# Altium schematic sheet E17-04_BSPD.SchDoc
size B; DocumentNumber: 10; SheetNumber: 10; SheetTotal: 18
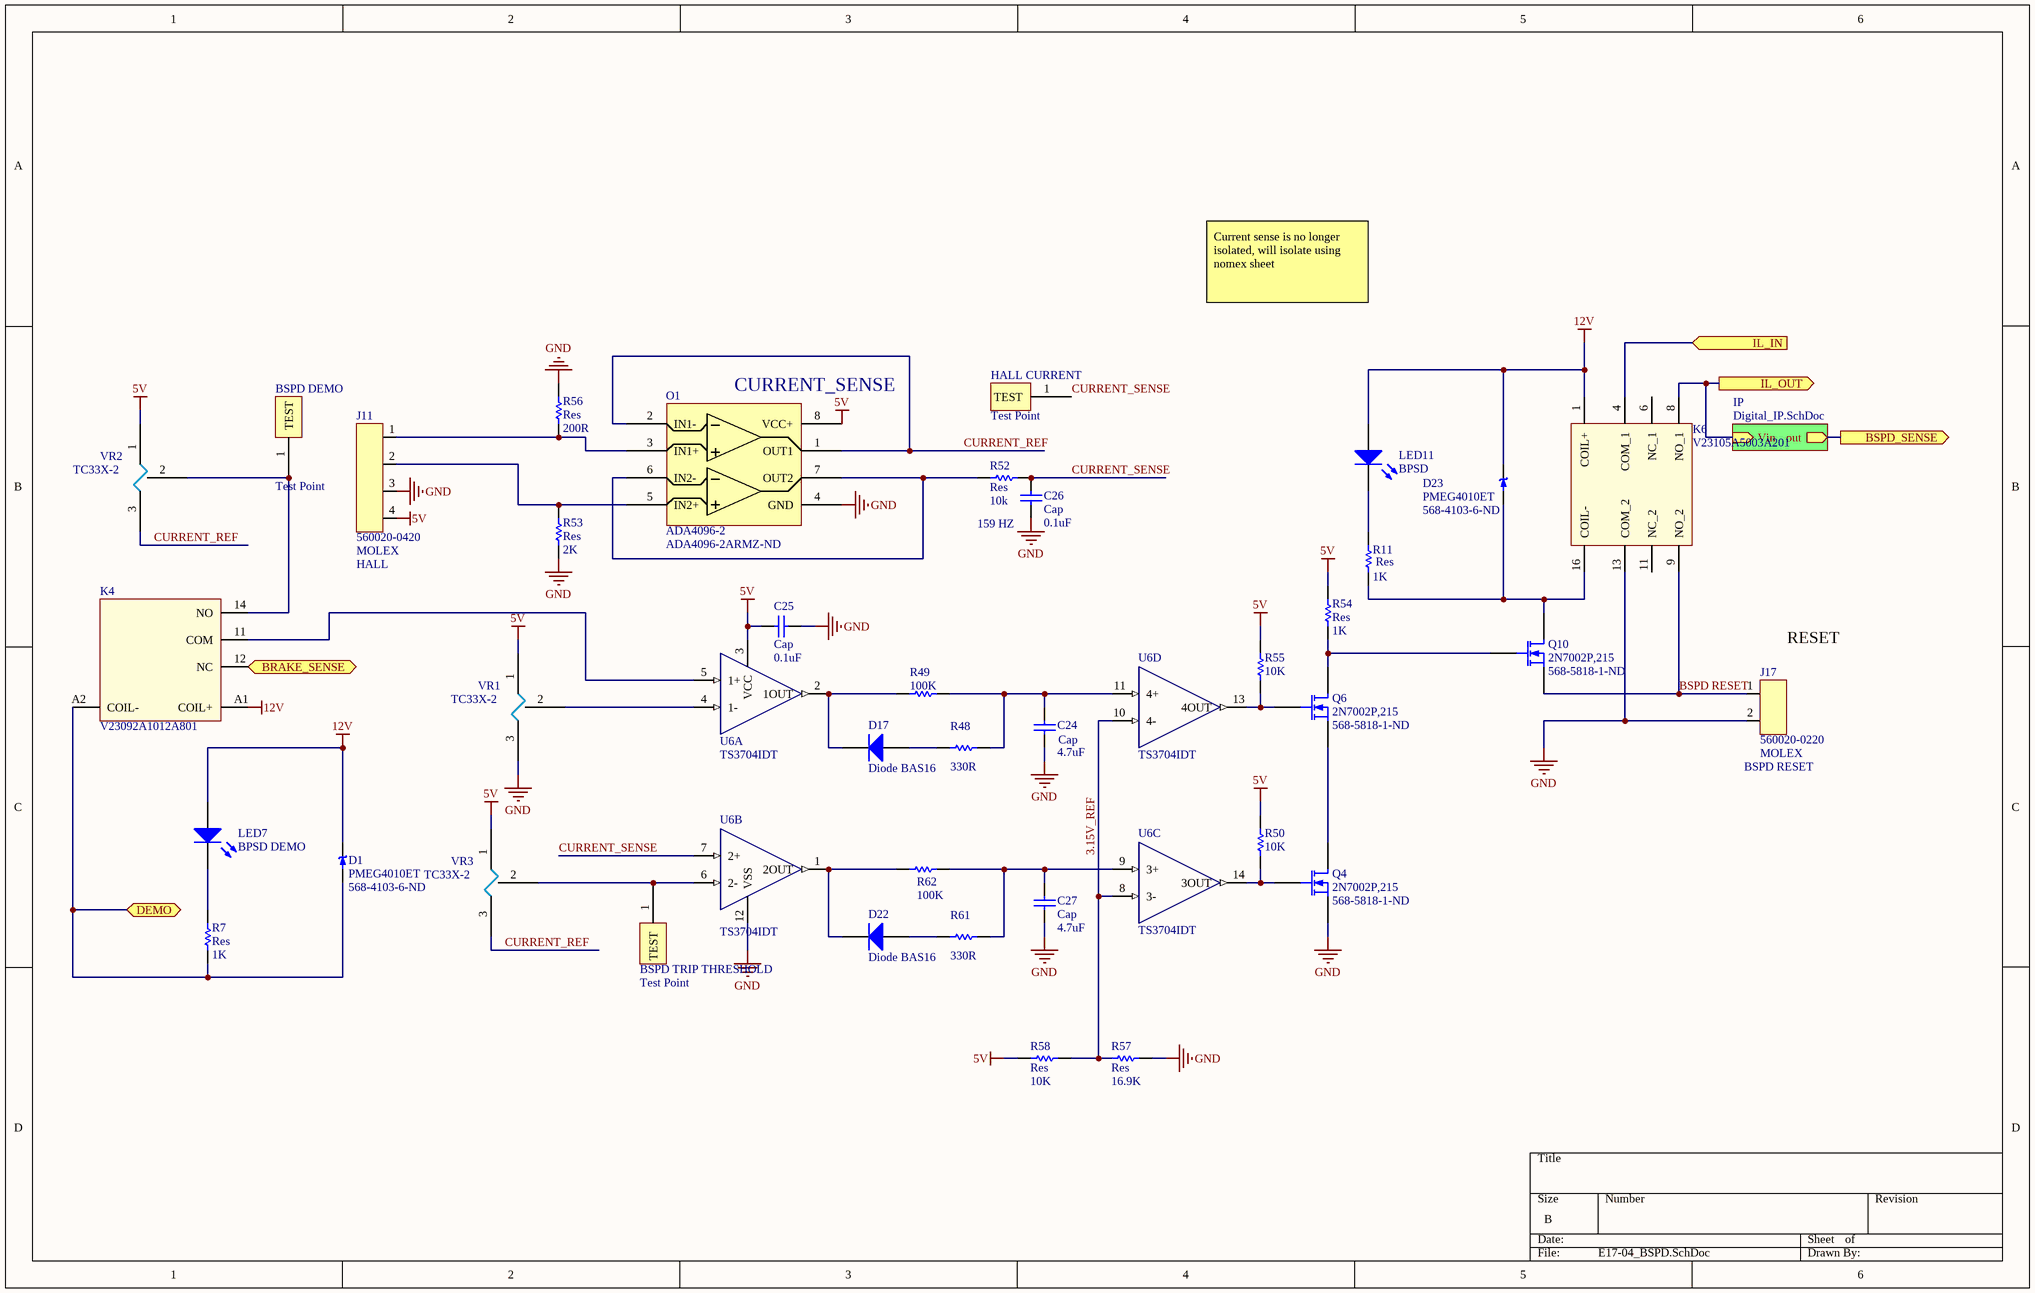
[diagram p0: E17-04_BSPD.SchDoc]

## Parts
BSPD_DEMO  Test Point  [TEST POINT 5000K]
BSPD_TRIP_THRESHOLD  Test Point  [TEST POINT 5000K]
C24  Cap  value 4.7uF  [C0805]
C25  Cap  value 0.1uF  [C0805]
C26  Cap  value 0.1uF  [C0805]
C27  Cap  value 4.7uF  [C0805]
D1  PMEG4010ET  Supplier Part Number 1: 568-4103-6-ND  [SOT23-3]
D17  Diode BAS16  [SOT-23_N]
D22  Diode BAS16  [SOT-23_N]
D23  PMEG4010ET  Supplier Part Number 1: 568-4103-6-ND  [SOT23-3]
HALL_CURRENT  Test Point  [TEST POINT 5000K]
J11  MANUFACTURER: MOLEX  [MOLEX_DURACLIK_4 NAT VERT]  (hidden comment: HALL)
J17  BSPD RESET  MANUFACTURER: MOLEX  [MOLEX_DURACLIK_2 NAT VERT]
K4  V23092A1012A801  [SCHRACK]
K6  MFG_PN: V23105A5003A201  [K_V23105A5003A201]  (hidden comment: K_V23105A5003A201)
LED7  BPSD DEMO  [155124VS73200]
LED11  BPSD  [155124VS73200]
O1  ADA4096-2  Supplier Part Number 1: ADA4096-2ARMZ-ND  [TSSOP8]
Q4  2N7002P,215  Supplier Part Number 1: 568-5818-1-ND  [SOT23-3]
Q6  2N7002P,215  Supplier Part Number 1: 568-5818-1-ND  [SOT23-3]
Q10  2N7002P,215  Supplier Part Number 1: 568-5818-1-ND  [SOT23-3]
R7  Res  value 1K  [2012[0805]]
R11  Res  value 1K  [2012[0805]]
R48  value 330R  [2012[0805]]  (hidden comment: Res)
R49  value 100K  [2012[0805]]  (hidden comment: Res)
R50  value 10K  [2012[0805]]  (hidden comment: Res)
R52  Res  value 10k  [2012[0805]]
R53  Res  value 2K  [2012[0805]]
R54  Res  value 1K  [2012[0805]]
R55  value 10K  [2012[0805]]  (hidden comment: Res)
R56  Res  value 200R  [2012[0805]]
R57  Res  value 16.9K  [2012[0805]]
R58  Res  value 10K  [2012[0805]]
R61  value 330R  [2012[0805]]  (hidden comment: Res)
R62  value 100K  [2012[0805]]  (hidden comment: Res)
U6  MFG_PN: TS3704IDT  [14-SOIC]  (hidden comment: U_TS3704IDT)  (parts A,B,C,D of 4)
VR1  TC33X-2  [TC33X-2]
VR2  TC33X-2  [TC33X-2]
VR3  TC33X-2  [TC33X-2]

## Sub-sheets
IP = Digital_IP.SchDoc: Vin (in), out (out)

## Ports
BRAKE_SENSE (in), BSPD_SENSE (out), DEMO (bidir), IL_IN (in), IL_OUT (out)

## Nets
5V: C25.2 J11.4 O1.8(VCC+) R50.2 R54.1 R55.2 R58.2 U6.3(VCC) VR1.1 VR2.1 VR3.1
12V: D1.3 D23.3 K4.A1(COIL+) K6.1(COIL+) LED7.2 LED11.2
GND: C24.1 C25.1 C26.1 C27.1 J11.3 J17.2 K6.13(COM_2) O1.4(GND) Q4.2(S) R53.1 R56.1 R57.1 U6.12(VSS) VR1.3
3.15V_REF: R57.2 R58.1 U6.8(3-) U6.10(4-)
BRAKE_SENSE: K4.12(NC) ; port BRAKE_SENSE
BSPD RESET: J17.1 K6.9(NO_2) Q10.2(S)
BSPD_SENSE: port BSPD_SENSE, sheet IP/out
CURRENT_REF: O1.1(OUT1) O1.2(IN1-) VR2.3 VR3.3
CURRENT_SENSE: C26.2 HALL_CURRENT.1(TEST) R52.1 U6.7(2+)
DEMO: D1.1 K4.A2(COIL-) R7.1 ; port DEMO
IL_IN: K6.4(COM_1) ; port IL_IN
IL_OUT: K6.8(NO_1) ; port IL_OUT, sheet IP/Vin
NetBSPD_DEMO_1: BSPD_DEMO.1(TEST) K4.14(NO) VR2.2
NetBSPD_TRIP_THRESHOLD_1: BSPD_TRIP_THRESHOLD.1(TEST) U6.6(2-) VR3.2
NetC24_2: C24.2 R48.2 R49.2 U6.11(4+)
NetC27_2: C27.2 R61.2 R62.2 U6.9(3+)
NetD17_1: D17.1(A) R48.1
NetD17_3: D17.3(K) R49.1 U6.2(1OUT)
NetD22_1: D22.1(A) R61.1
NetD22_3: D22.3(K) R62.1 U6.1(2OUT)
NetD23_1: D23.1 K6.16(COIL-) Q10.3(D) R11.1
NetJ11_1: J11.1 O1.3(IN1+) R56.2
NetJ11_2: J11.2 O1.5(IN2+) R53.2
NetK4_11: K4.11(COM) U6.5(1+)
NetLED7_1: LED7.1 R7.2
NetLED11_1: LED11.1 R11.2
NetO1_6: O1.6(IN2-) O1.7(OUT2) R52.2
NetQ4_1: Q4.1(G) R50.1 U6.14(3OUT)
NetQ4_3: Q4.3(D) Q6.2(S)
NetQ6_1: Q6.1(G) R55.1 U6.13(4OUT)
NetQ6_3: Q6.3(D) Q10.1(G) R54.2
NetU6_4: U6.4(1-) VR1.2

Not connected (* = marked no-connect by the designer): K6 6(NC_1) 11(NC_2)

## Notes on the sheet
- Current sense is no longer isolated, will isolate using nomex sheet
- (near O1) CURRENT_SENSE
- (near C26) 159 HZ
- (near J17) RESET

## Library data of the parts
BSPD_DEMO BSPD_TRIP_THRESHOLD HALL_CURRENT = Test Point: 5000-5004, 5015-5019 Keystone Electronics
C24-C27 = Cap: Capacitor; Published: 8-Jun-2000; LatestRevisionDate: 17-Jul-2002; LatestRevisionNote: Re-released for DXP Platform.; PackageReference: C1206; Publisher: Altium Limited
D1 D23 = PMEG4010ET: SCHOTTKY RECT 40V 1A SOT-23; Supplier 1: Digi-Key
D17 D22 = Diode BAS16: Silicon Switching Diode for High-Speed Switching; Note: Pin 2 is not connected and not drawn.; Published: 21-Mar-2003; LatestRevisionDate: 29-May-2009; LatestRevisionNote: IPC-7351 Footprint Added.; DatasheetVersion: Oct-1999; PackageVersion: Sep-2001; PackageReference: SOT-23; Publisher: Altium Limited; PackageDescription: 3-Pin SOT-23 Package 0.95 mm Pitch, 2.5 mm Lead Span; ComponentLink1Description: Manufacturer Link; ComponentLink1URL: http://www.infineon.com/; ComponentLink2Description: Datasheet; ComponentLink2URL: http://www.infineon.com/upload/Document/cmc_upload/documents/012/5331/bas16series.pdf
J11 = 560020-0420: MOLEX DURACLIK 4-PIN VERT NAT; POSITIONS: 4; UL: 94V-0; VOLTAGE: 125; CURRENT: 3; PLATING: Tin (Sn); Digikey_PN: Not in production; COLOR: NAT; SERIES: Duraclik; ORIENTATOIN: VERT; MPN: 560020-0420; COMMENT_1: HALL; Comment_2: 560020-0420
J17 = 560020-0220: MOLEX DURACLIK 2-PIN VERT NAT; POSITIONS: 2; UL: 94V-0; VOLTAGE: 125; CURRENT: 3; PLATING: Tin (Sn); Digikey_PN: Not in production; COLOR: NAT; SERIES: Duraclik; ORIENTATOIN: VERT; MPN: 560020-0220; Comment_1: BSPD RESET
K4 = V23092A1012A801: 12V slim SPDT Relay; MFG: TE; DC Contact Voltage: 300; Coil Voltage: 12; Coil Current: 0.0142; DIGIKEY_PN: PB2044-ND; Supplier 1: Digikey; Supplier Part Number 1: PB2044-ND; MFG_PN: V23092A1012A801
K6 = K_V23105A5003A201: RELAY DPDT 12V/12.5mA, 220V/3A; MFG: TE; DIGIKEY_PN: PB384-ND
LED7 LED11 = 155124VS73200: Right Angle SMD Green 2V; Manufacturer: Wurth Electronics Inc; Lens Color: Colorless; Lens Transparency: Clear; Millicandela Rating: 50mcd; Lens Style/Size: Rectangle with Domed Top, 2.00mm x 1.00mm; Current - Test: 20mA; Viewing Angle: 120°; Wavelength - Dominant: 573nm; Wavelength - Peak: 575nm; Supplier 1: Digi-Key; Supplier Part Number 1: 732-5026-1-ND; RoHS: RoHS Compliant; Category: Optoelectronics; Stock 1: 4820; Pricing 1: 1=0.44, 50=0.3802, 100=0.3476, 500=0.31498, 1000=0.29326 (CAD); Packaging: Cut Tape (CT); Color: Green; Voltage - Forward (Vf) (Typ): 2V; Mounting Type: Surface Mount, Right Angle; Features: -; Package / Case: 2-SMD, Side View; Supplier Device Package: 1204; Size / Dimension: 3.20mm L x 1.50mm W; Height (Max): 1.20mm; ComponentLink1URL: http://katalog.we-online.de/led/datasheet/155124VS73200.pdf; ComponentLink1Description: http://katalog.we-online.de/led/datasheet/155124VS73200.pdf; Manufacturer Part Number: 155124VS73200
O1 = ADA4096-2: 2 Op-Amps, 8-TSSOP, 32V Overvoltage Protection; Supplier 1: Digi-Key
Q4 Q6 Q10 = 2N7002P,215: N-Channel Enhancement Mode Vertical DMOS FET; PackageReference: SOT23; PackageDescription: SOT-23; 3 Leads; Body 3.1 x 2.5 mm, inc. leads (LxW max), Alternate Lead Configuration; Supplier 1: Digi-Key
R7 R11 R48-R50 R52-R58 R61 R62 = Res: Surface Mount Resistor; Published: 8-Jun-2000; LatestRevisionDate: 17-Jul-2002; LatestRevisionNote: Re-released for DXP Platform.; PackageReference: AXIAL-0.5; Publisher: Altium Limited
U6 = U_TS3704IDT: QUAD COMPARATOR 14-SOIC PUSH-PULL; MFG: STMicroelectronics; DIGIKEY_PN: 497-2269-1-ND
VR1-VR3 = TC33X-2: Supplier 1: Digi-Key; Supplier Part Number 1: TC33X-103ETR-ND